# EAGLE design MINI_Sam_2016_09_28_003 (EAGLE 7.6.0)
DESIGNER: BENJAMIN SHOCKLEY; REV: A
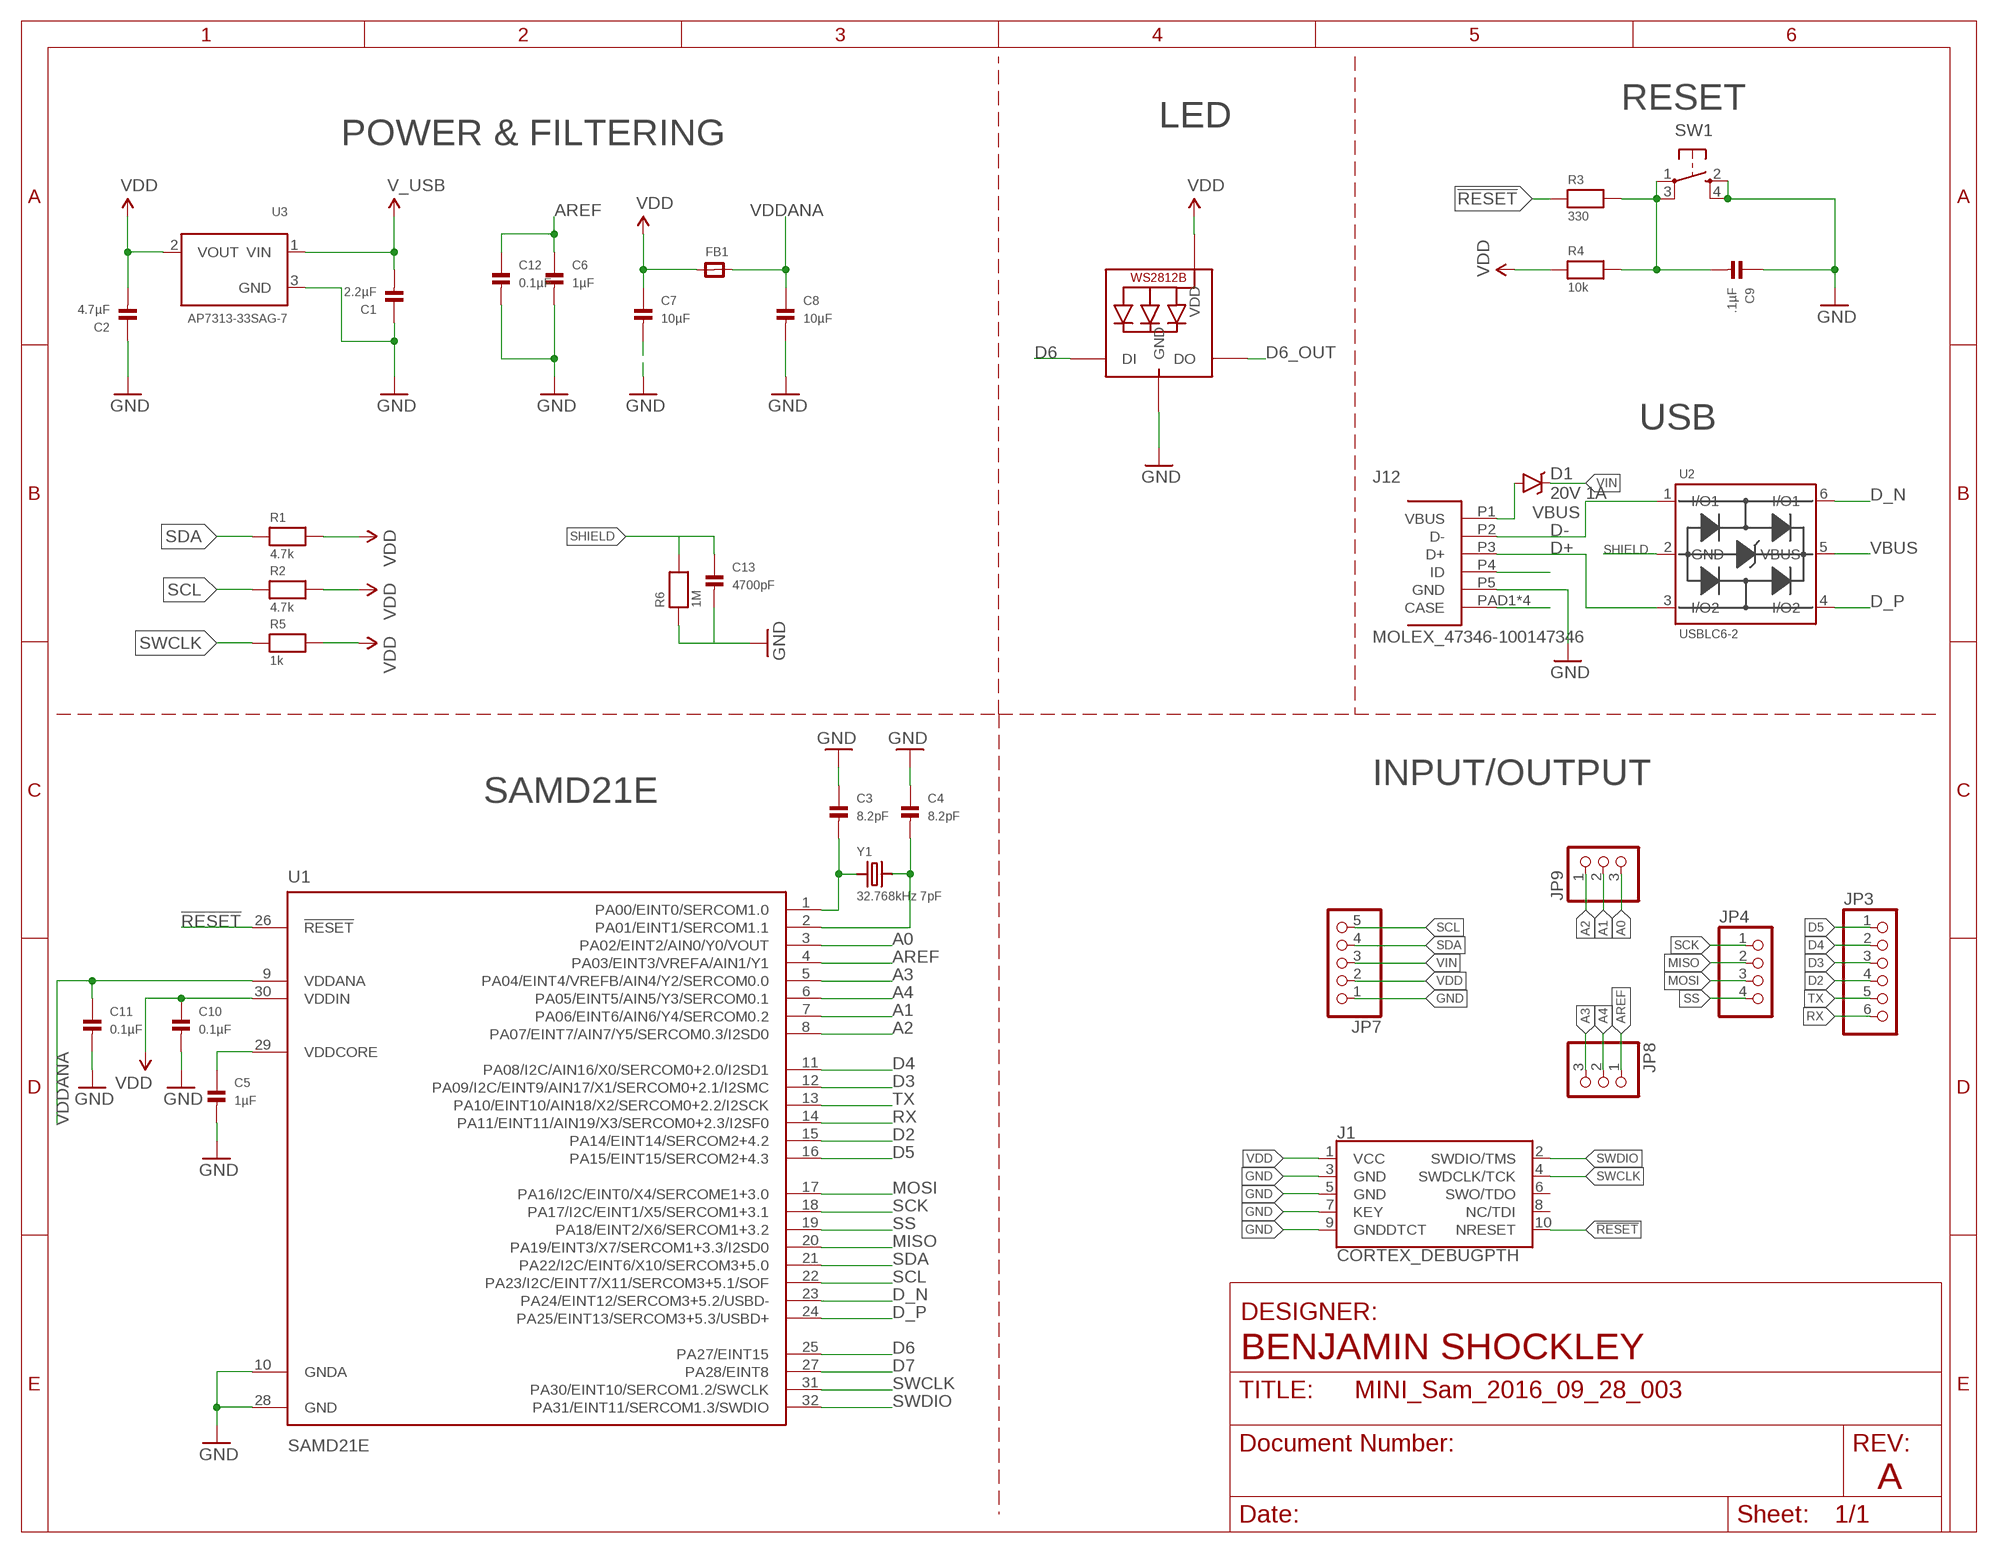
[diagram p0: schematic, sheet 1]

## Parts
C1  2.2µF  CAP_CERAMIC_0805MP  [_0805MP]
C2  4.7µF  CAP_CERAMIC_0805MP  [_0805MP]
C3  8.2pF  CAP_CERAMIC_0805MP  [_0805MP]
C4  8.2pF  CAP_CERAMIC_0805MP  [_0805MP]
C5  1µF  CAP_CERAMIC_0805MP  [_0805MP]
C6  1µF  CAP_CERAMIC_0805MP  [_0805MP]
C7  10µF  CAP_CERAMIC_0805MP  [_0805MP]
C8  10µF  CAP_CERAMIC_0805MP  [_0805MP]
C9  .1µF  CAP_CERAMIC_0805MP  [_0805MP]
C10  0.1µF  CAP_CERAMIC_0805MP  [_0805MP]
C11  0.1µF  CAP_CERAMIC_0805MP  [_0805MP]
C12  0.1µF  CAP_CERAMIC_0805MP  [_0805MP]
C13  4700pF  CAP_CERAMIC_0805MP  [_0805MP]
D1  20V 1A  DIODE-SCHOTTKY-0805  [_0805MP]
FB1  FERRITE_0805MP  [_0805MP]
J1  CORTEX_DEBUGPTH  [2X5-PTH-1.27MM]
J12  MOLEX_47346-100147346  [MOLEX_47346-1001]
JP3  HEADER-1X6ROUND  [1X06_ROUND]
JP4  HEADER-1X4ROUND  [1X04_ROUND]
JP7  HEADER-1X5ROUND  [1X05_ROUND]
JP8  HEADER-1X3ROUND  [1X03_ROUND]
JP9  HEADER-1X3ROUND  [1X03_ROUND]
LED  WS2812B3535  [LED3535]
R1  4.7k  RESISTOR_0805MP  [_0805MP]
R2  4.7k  RESISTOR_0805MP  [_0805MP]
R3  330  RESISTOR_0805MP  [_0805MP]
R4  10k  RESISTOR_0805MP  [_0805MP]
R5  1k  RESISTOR_0805MP  [_0805MP]
R6  1M  RESISTOR_0805MP  [_0805MP]
SW1  SPST_TACT-KMR2  [KMR2]
U1  SAMD21E  [QFN32]
U2  USBLC6-2  [SOT23-6L]
U3  AP7313-33SAG-7  VREG_SOT23  [SOT23-R]
Y1  32.768kHz 7pF  CRYSTAL0805PACKAGE  [_0805MP]

## Nets
!RESET: J1.10(NRESET) R3.1 U1.26(!RESET)
A0: JP9.3 U1.3(PA02/EINT2/AIN0/Y0/VOUT)
A1: JP9.2 U1.7(PA06/EINT6/AIN6/Y4/SERCOM0.2)
A2: JP9.1 U1.8(PA07/EINT7/AIN7/Y5/SERCOM0.3/I2SD0)
A3: JP8.3 U1.5(PA04/EINT4/VREFB/AIN4/Y2/SERCOM0.0)
A4: JP8.2 U1.6(PA05/EINT5/AIN5/Y3/SERCOM0.1)
AREF: C6.1 C12.1 JP8.1 U1.4(PA03/EINT3/VREFA/AIN1/Y1)
D2: JP3.4 U1.15(PA14/EINT14/SERCOM2+4.2)
D3: JP3.3 U1.12(PA09/I2C/EINT9/AIN17/X1/SERCOM0+2.1/I2SMC)
D4: JP3.2 U1.11(PA08/I2C/AIN16/X0/SERCOM0+2.0/I2SD1)
D5: JP3.1 U1.16(PA15/EINT15/SERCOM2+4.3)
D6: LED.1(DI) U1.25(PA27/EINT15)
D6_OUT: LED.3(DO)
D7: U1.27(PA28/EINT8)
D+ [USB_DATA]: J12.P3(D+) U2.3(I/O2)
D- [USB_DATA]: J12.P2(D-) U2.1(I/O1)
D_N [USB_DATA]: U1.23(PA24/EINT12/SERCOM3+5.2/USBD-) U2.6(I/O1)
D_P [USB_DATA]: U1.24(PA25/EINT13/SERCOM3+5.3/USBD+) U2.4(I/O2)
GND: C1.1 C2.1 C3.1 C4.1 C5.2 C6.2 C7.2 C8.2 C9.1 C10.2 C11.2 C12.2 C13.2 J1.3(GND) J1.5(GND) J1.7(KEY) J1.9(GNDDTCT) J12.P5(GND) JP7.1 LED.4(GND) R6.1 SW1.2(S) SW1.4(S1) U1.10(GNDA) U1.28(GND) U3.3(GND)
MISO: JP4.2 U1.20(PA19/EINT3/X7/SERCOM1+3.3/I2SD0)
MOSI: JP4.3 U1.17(PA16/I2C/EINT0/X4/SERCOME1+3.0)
N$1: C3.2 U1.1(PA00/EINT0/SERCOM1.0) Y1.1
N$2: C9.2 R3.2 R4.2 SW1.1(P) SW1.3(P1)
N$5: C4.2 U1.2(PA01/EINT1/SERCOM1.1) Y1.2
N$9: C5.1 U1.29(VDDCORE)
N$10: J12.P4(ID)
RX: JP3.6 U1.14(PA11/EINT11/AIN19/X3/SERCOM0+2.3/I2SF0)
SCK: JP4.1 U1.18(PA17/I2C/EINT1/X5/SERCOM1+3.1)
SCL: JP7.5 R2.1 U1.22(PA23/I2C/EINT7/X11/SERCOM3+5.1/SOF)
SDA: JP7.4 R1.1 U1.21(PA22/I2C/EINT6/X10/SERCOM3+5.0)
SHIELD: C13.1 J12.PAD1(CASE) J12.PAD2(CASE) J12.PAD3(CASE) J12.PAD4(CASE) R6.2 U2.2(GND)
SS: JP4.4 U1.19(PA18/EINT2/X6/SERCOM1+3.2)
SWCLK: J1.4(SWDCLK/TCK) R5.1 U1.31(PA30/EINT10/SERCOM1.2/SWCLK)
SWDIO: J1.2(SWDIO/TMS) U1.32(PA31/EINT11/SERCOM1.3/SWDIO)
TX: JP3.5 U1.13(PA10/EINT10/AIN18/X2/SERCOM0+2.2/I2SCK)
VBUS: D1.1(A) J12.P1(VBUS) U2.5(VBUS)
VDD: C2.2 C7.1 C10.1 FB1.1 J1.1(VCC) JP7.2 LED.2(VDD) R1.2 R2.2 R4.1 R5.2 U1.30(VDDIN) U3.2(VOUT)
VDDANA: C8.1 C11.1 FB1.2 U1.9(VDDANA)
VIN: C1.2 D1.2(C) JP7.3 U3.1(VIN) ; supply symbol labelled V_USB
Unconnected: J1.6(SWO/TDO) J1.8(NC/TDI)

## Notes on the sheet
- RESET
- LED
- POWER & FILTERING
- USB
- INPUT/OUTPUT
- SAMD21E
- DESIGNER:

## Library data of the parts
C1-C13 = microbuilder:CAP_CERAMIC: Ceramic Capacitors 0402 - 0402 Surface Mount Capacitors 16pF 50V 5% [Digikey: 445-4899-2-ND] 18pF 50V 5% [Digikey: 490-1281-2-ND] 22pF 50V 5% [Digikey: 490-1283-2-ND] 68pF 50V 5% [Digikey: 490-1289-2-ND] 0.1uF 10V 10% [Digikey: 490-1318-2-ND] 1.0uF 6.3V 10% [Digikey: 490-1320-2-ND] 0603 - 0603 Surface Mount Capacitors 16 pF 50V 5% [Digikey: 445-5051-2-ND] 22 pF 50V [Digikey: PCC220ACVTR-ND] 33 pF 50V 5% [Digikey: 490-1415-1-ND] 56pF 50V 5% [Digikey: 490-1421-1-ND] 220pF 50V 5% [Digikey: 445-1285-1-ND] 680 pF 50V 2200 pF 50V 5% C0G [Digikey: 445-1297-1-ND] 5600 pF 100V 5% X7R [Digikey: 478-3711-1-ND] 0.1 µF 25V 10% [Digikey: PCC2277TR-ND] 0.22 µF 16V 10% X7R [Digikey: 445-1318-1-ND] 1.0 µF 25V 10% [Digikey: 445-5146-2-ND] 0603 - RF Specific 3pF 250V +/-0.1pF RF [Digikey: 712-1347-1-ND] 18 pF 250V 5% [Digikey: 478-3505-1-ND or 712-1322-1-ND] 56 pF 250V 5% C0G RF [Digikey: 490-4867-1-ND] 68 pF 250V RF [Digikey: 490-4868-1-ND] 0805 - 0805 Surface Mount Capacitors 220 pF 250V 2% RF Ceramic Capacitor [Digikey: 712-1398-1-ND] 1000 pF 50V 2% NP0 Ceramic Capacitor [Digikey: 478-3760-1-ND] 0.1 µF 25V 10% Ceramic Capacitor [Digikey: PCC1828TR-ND] 1.0 µF 16V 10% Ceramic Capacitor[Digikey: 490-1691-2-ND] 10.0 µF 10V 10% Ceramic Capacitor[Digikey: 709-1228-1-ND] 10.0 uF 16V 10% Ceramic Capacitor [Digikey: 478-5165-2-ND] 47 uF 6.3V 20% Ceramic Capacitor [Digikey: 587-1779-1-ND or 399-5506-1-ND] 1206 - 1206 Surface Mount Capacitors 47uF 10V 20% Ceramic Capacitor [Digikey: 490-5528-1-ND or 399-5508-1-ND or 445-6010-1-ND] 100uF 6.3V -20%, +80% Y5V Ceramic Capacitor (Digikey: 490-4512-1-ND, Mouser: 81-GRM31CF50J107ZE1L)
D1 = Shockley_Custom:DIODE-SCHOTTKY: Schottky diodes in SFE's production catalog BAT20J 1A 23V 0.62Vf RB751 120mA 40V 0.37Vf PMEG4005EJ 0.5A 40V 0.42Vf MBRA140 1A 40V 0.5Vf B340A 3A 40V SMA
FB1 = microbuilder:FERRITE: Ferrite Bead 0603 MMZ1608B121C - 120 Ohm @ 100MHz, 600mA, 0.15 Ohm DC Resistance - Digikey: 445-2164-1-ND BK1608HW121-T - 120 Ohm, 600mA Ferrite Chip - Digikey: 587-1876-2-ND 0805 HZ0805B272R-10 - 2.7K Ohm @ 100MHz, 200mA, 0.8 Ohm DC Resistance - Digikey: 240-2504-1-ND (see also Murata BLM21BD272SN1L) MMZ2012Y152B - 1.5K Ohm @ 100MHz, 500mA, 0.4 Ohm DC Resistance - Digikey: 445-1560-1-ND - Mainly for high frequency (80-400MHz) MMZ2012R102A - 1K Ohm @ 100MHz, 500mA, 0.3 Ohm DC Resistance - Digikey: 445-1555-2-ND - More general purpose (10-200MHz)
J1 = SparkFun-Connectors:CORTEX_DEBUG: Cortex Debug Connector Datasheet <http://infocenter.arm.com/help/topic/com.arm.doc.faqs/attached/13634/cortex_debug_connectors.pdf>
J12 = Shockley_Custom:MOLEX_47346-1001
JP3 = microbuilder:HEADER-1X6: PIN HEADER
JP4 = microbuilder:HEADER-1X4: PIN HEADER
JP7 = microbuilder:HEADER-1X5: PIN HEADER
JP8 JP9 = microbuilder:HEADER-1X3: PIN HEADER
LED = adafruit:WS2812B
R1-R6 = microbuilder:RESISTOR: Resistors 0402 - 0402 Surface Mount Package 22 Ohm 1% 1/16W [Digikey: 311-22.0LRTR-ND] 33 Ohm 5% 1/16W 1.0K 5% 1/16W 1.5K 5% 1/16W 2.0K 1% 1/16W 10.0K 1% 1/16W [Digikey: 311-10.0KLRTR-ND] 10.0K 5% 1/16W [Digikey: RMCF0402JT10K0TR-ND] 12.1K 1% 1/16W [Digikey: 311-22.0LRTR-ND] 100.0K 5% 1/16W 0603 - 0603 Surface Mount Package 0 Ohm 1/10 Watt 1% Resistor 15 Ohm 1/10 Watt 1% Resistor 33 Ohm 1/10 Watt 1% Resistor 49.9 Ohm 1/10 Watt 1% Resistor 100 Ohm 1/10 Watt 1% Resistor 150 Ohm 1/10 Watt 1% Resistor 240 Ohm 1/10 Watt 1% Resistor 390 Ohm 1/10 Watt 1% Resistor 560 Ohm 1/10 Watt 1% Resistor 680 Ohm 1/10 Watt 1% Resistor 750 Ohm 1/10 Watt 1% Resistor 1.0K Ohm 1/10 Watt 1% Resistor 1.5K Ohm 1/10 Watt 1% Resistor 2.0K Ohm 1/10 Watt 1% Resistor 2.2K Ohm 1/10 Watt 1% Resistor 3.3K Ohm 1/10 Watt 1% Resistor 4.7K Ohm 1/10 Watt 1% Resistor 10.0K Ohm 1/10 Watt 1% Resistor 12.0K Ohm 1/10 Watt 1% Resistor 12.1K Ohm 1/10 Watt 1% Resistor 20.0K Ohm 1/10 Watt 1% Resistor 33.0K Ohm 1/10 Watt 1% Resistor 100.0K Ohm 1/10 Watt 1% Resistor 0805 - 0805 Surface Mount Package 0 Ohm 1/8 Watt 1% Resistor 33 Ohm 1/8 Watt 1% Resistor 100 Ohm 1/8 Watt 1% Resistor 150 Ohm 1/8 Watt 1% Resistor 200 Ohm 1/8 Watt 1% Resistor 240 Ohm 1/8 Watt 1% Resistor 330 Ohm 1/8 Watt 1% Resistor 390 Ohm 1/8 Watt 1% Resistor 470 Ohm 1/8 Watt 1% Resistor 1.0K Ohm 1/8 Watt 1% Resistor 1.5K Ohm 1/8 Watt 1% Resistor 2.0K Ohm 1/8 Watt 1% Resistor 4.7K Ohm 1/8 Watt 1% Resistor 5.1K Ohm 1/8 Watt 1% Resistor 5.6K Ohm 1/8 Watt 1% Resistor 10.0K Ohm 1/8 Watt 1% Resistor 22.0K Ohm 1/8 Watt 1% Resistor 33.0K Ohm 1/8 Watt 1% Resistor 100K Ohm 1/8 Watt 1% Resistor 1206 - 1206 Surface Mount Package 2012 - 2010 Surface Mount Package 0.11 Ohm 1/2 Watt 1% Resistor - Digikey: RHM.11UCT-ND
SW1 = adafruit:SPST_TACT: SMT 6mm switch, EVQQ2 series http://www.ladyada.net/library/eagle
U1 = Shockley_Custom:SAMD21E
U2 = Shockley_Custom:USBLC6-2
U3 = microbuilder:VREG_SOT23: SOT23 Fixed Voltage Regulators Part Current Out V Out V In V Dropout Digikey Part No. AP7313 150mA 3.3V 3.5-6V 0.15V @ 150mA AP7313-33SAG-7DICT-ND
Y1 = Shockley_Custom:CRYSTAL: Crystals HC49UP - Surface Mount Crystal 4.0MHz 18pF +/-30ppm Surface Mount Crystal [Digikey: 535-9857-1-ND] 12.0 MHz Surface Mount Crystal [Digikey: 535-9869-6-ND] 25.0 MHz Surface Mount Crystal [Digikey: 535-9078-1-ND] 2.5 x 2.0mm - MEMs SMT Crystal 16.0 MHz 10pF 20ppm 2.5 x 2.0mm Crystal [Digikey -40-85°C: 535-10923-1-ND] 3.2 x 2.5mm - MEMs SMT Crystal 12.0 MHz 8pF 15ppm 3.2 x 2.5mm Crystal [Digikey: -10-70°C: 644-1047-1-ND -40-125°C: 644-1128-1-ND] 16.0 MHz 8pF 15ppm 3.2 x 2.5mm Crystal [Digikey: -10-70°C: 644-1049-1-ND -40-125°C: 644-1129-2-ND] 16.0 MHz 10pF 10ppm 3.2 x 2.5mm Crystal [Digikey: 644-1100-1-ND] 27.12 MHz 18pF 30ppm 3.2 x 2.5mm Crystal [Digikey: 887-1424-1-ND] 27.12MHz 10pF 10ppm 3.2 x 2.5mm Crystal [Digikey: 887-1329-1-ND] 4.9 x 1.8mm - MEMs SMT Crystal 32.768 KHz 12.5pF 20ppm 4.9 x 1.8mm Crystal [Digikey: SE2415CT-ND] 8.0 x 3.8mm - Surface Mount Crystal 32.768kHz 12.5pF 20ppm -40°C-85°C [Digikey: 535-9166-2-ND] Cylinder 32.768KHz Cylinder Crystal (2x6mm body) [Ex. Digikey: 300-8341-2-ND]

## Board
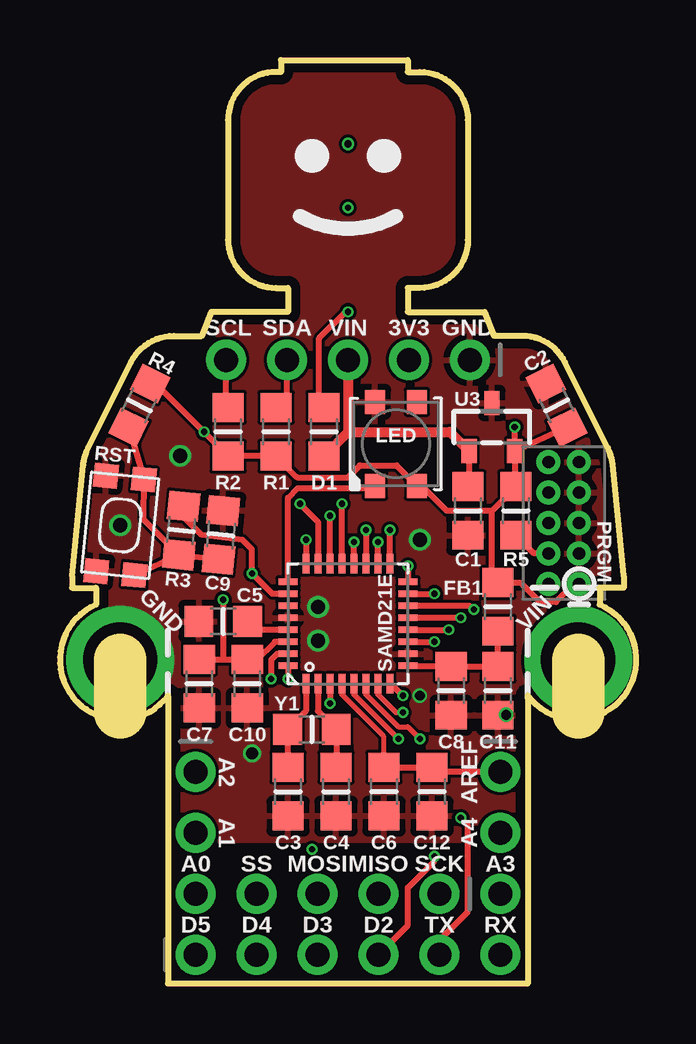
[diagram p1: board, top side]
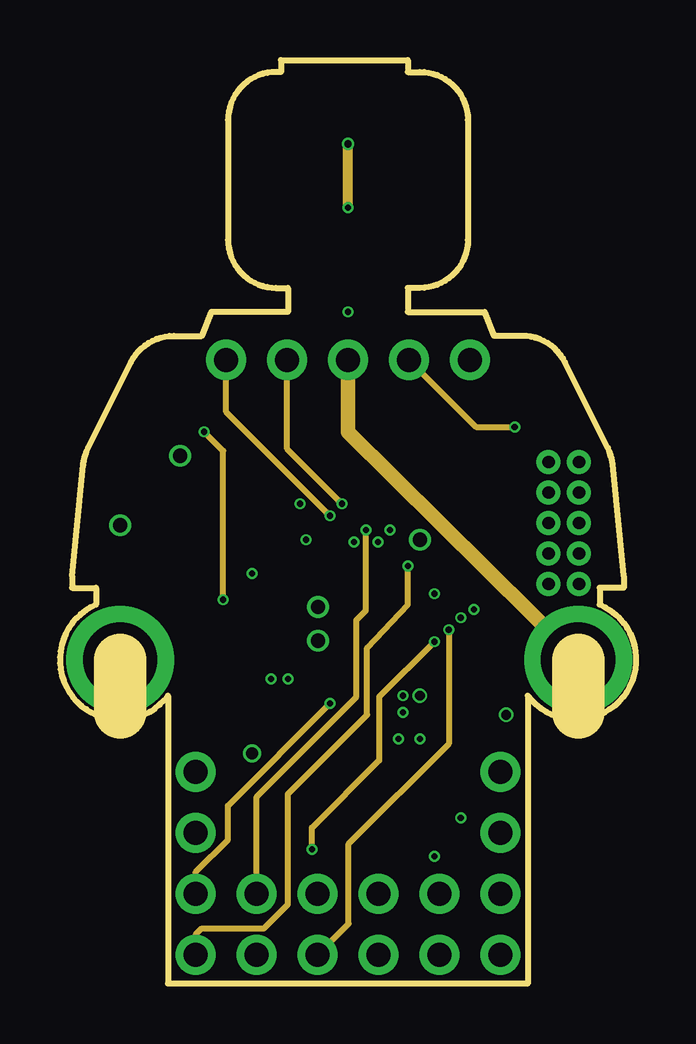
[diagram p2: board, inner layer Route2]
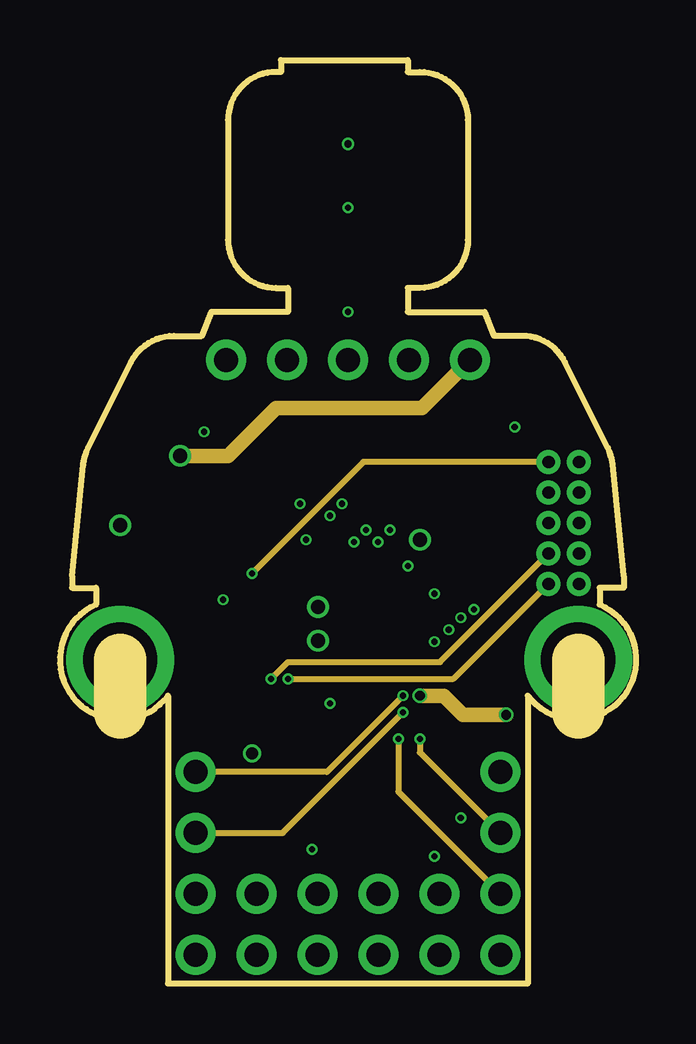
[diagram p3: board, inner layer Route15]
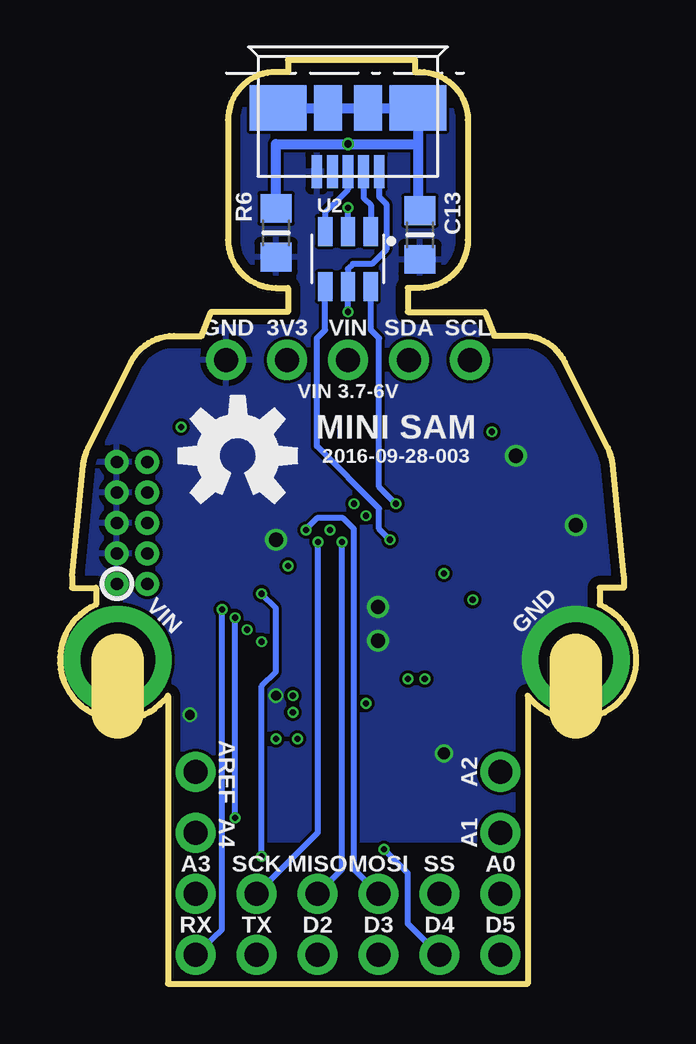
[diagram p4: board, bottom side, seen from below]

Size 24.02 x 38.5 mm. Coordinates in mm from the lower left corner, seen from the top.
Outline: 9.21,38.5 14.51,38.5 14.51,38 15.01,38 arc-90 17.01,36 17.01,31 arc-90 15.01,29 14.51,29 14.51,28 17.71,28 18.11,27 19.27,27 arc-63 21.06,25.89 22.84,22.33 arc-21 23.05,21.63 23.51,17 23.51,16.5 22.51,16.5 22.51,15.8 arc-210 19.51,12 19.51,0 4.51,0 4.51,12 arc-210 1.51,15.8 1.51,16.5 0.51,16.5 0.51,17 0.97,21.63 arc-21 1.17,22.33 2.96,25.89 arc-63 4.75,27 5.91,27 6.31,28 9.51,28 9.51,29 9.01,29 arc-90 7.01,31 7.01,36 arc-90 9.01,38 9.21,38 9.21,38.5
Copper layers (1*2*15*16): Top 0.035559375mm / dielectric 0.17018125mm / Route2 0.01778125mm / dielectric 47mil / Route15 0.01778125mm / dielectric 0.17018125mm / Bottom 0.035559375mm
Design rules "OSHPark-4layer": minimum track width 5mil, minimum drill 10mil, track to track 5mil, track to pad 5mil, pad to pad 5mil, via to via 5mil, smd to smd 5mil, copper to edge 15mil, drill to drill 6mil, minimum pad ring 4mil, minimum via ring 4mil, stop-mask expansion 2.5mil, vias tented up to drill 0mil, thermal gap 10mil
Milling: 2 lines

### Footprints (pad centres in the part's own frame; a part is rotated, then mirrored left to right if it is on the bottom)
_0805MP = smd 1.2 x 1.3: 1 -1.016,0; 2 1.016,0
2X5-PTH-1.27MM = drill 0.508 pad 1: 1 -2.54,-0.635; 2 -2.54,0.635; 3 -1.27,-0.635; 4 -1.27,0.635; 5 0,-0.635; 6 0,0.635; 7 1.27,-0.635; 8 1.27,0.635; 9 2.54,-0.635; 10 2.54,0.635
MOLEX_47346-1001 = smd 0.45 x 1.38: P1 1.3,-2.66; P2 0.65,-2.66; P3 0,-2.66; P4 -0.65,-2.66; P5 -1.3,-2.66 | smd 2.375 x 1.9: PAD1 -2.913,0; PAD4 2.913,0 | smd 1.175 x 1.9: PAD2 -0.838,0; PAD3 0.838,0
1X06_ROUND = drill 1 pad 1.676: 1 -6.35,0; 2 -3.81,0; 3 -1.27,0; 4 1.27,0; 5 3.81,0; 6 6.35,0
1X04_ROUND = drill 1 pad 1.676: 1 -3.81,0; 2 -1.27,0; 3 1.27,0; 4 3.81,0
1X05_ROUND = drill 1 pad 1.676: 1 -5.08,0; 2 -2.54,0; 3 0,0; 4 2.54,0; 5 5.08,0
1X03_ROUND = drill 1 pad 1.676: 1 -2.54,0; 2 0,0; 3 2.54,0
LED3535 = smd 1 x 0.85: 1 -1.75,0.875; 2 -1.75,-0.875; 3 1.75,-0.875; 4 1.75,0.875
KMR2 = smd 1 x 1: 1 2,0.8; 2 2,-0.8; 3 -2,0.8; 4 -2,-0.8
QFN32 = smd 0.8 x 0.285: 1 -2.5,1.75; 2 -2.5,1.25; 3 -2.5,0.75; 4 -2.5,0.25; 5 -2.5,-0.25; 6 -2.5,-0.75; 7 -2.5,-1.25; 8 -2.5,-1.75; 17 2.5,-1.75; 18 2.5,-1.25; 19 2.5,-0.75; 20 2.5,-0.25; 21 2.5,0.25; 22 2.5,0.75; 23 2.5,1.25; 24 2.5,1.75 | smd 0.285 x 0.8: 9 -1.75,-2.5; 10 -1.25,-2.5; 11 -0.75,-2.5; 12 -0.25,-2.5; 13 0.25,-2.5; 14 0.75,-2.5; 15 1.25,-2.5; 16 1.75,-2.5; 25 1.75,2.5; 26 1.25,2.5; 27 0.75,2.5; 28 0.25,2.5; 29 -0.25,2.5; 30 -0.75,2.5; 31 -1.25,2.5; 32 -1.75,2.5
SOT23-6L = smd 0.6 x 1.2: 1 -0.95,-1.15; 2 0,-1.15; 3 0.95,-1.15; 4 0.95,1.15; 5 0,1.15; 6 -0.95,1.15
SOT23-R = smd 0.635 x 1.016: 1 -0.95,-1; 2 0.95,-1; 3 0,1

### Placement (x,y rotation side)
C1  17.01,19.7 90 top
C2  20.71,24.1 296.5 top
C3  9.51,8 90 top
C4  11.51,8 90 top
C5  6.81,15.1 180 top
C6  13.51,8 270 top
C7  5.81,12.5 270 top
C8  16.31,12.2 270 top
C9  6.71,18.7 264.3 top
C10  7.81,12.5 270 top
C11  18.26,12.2 270 top
C12  15.51,8 270 top
C13  9.01,31.2 270 bottom
D1  11.01,23 270 top
FB1  18.26,15.7 270 top
J1  21.01,19.2 90 top
J12  12.01,36.5 0 bottom
JP3  12.01,1.2 0 top
JP4  12.01,3.74 180 top
JP7  12.01,26 180 top
JP8  18.36,6.28 270 top
JP9  5.66,6.28 270 top
LED  14.01,22.5 90 top
R1  9.01,23 270 top
R2  7.01,23 270 top
R3  5.06,18.88 264.3 top
R4  3.31,24.1 243.5 top
R5  19.01,19.7 90 top
R6  15.01,31.3 90 bottom
SW1  2.51,19.1 264.3 top
U1  12.01,15 90 top
U2  12.01,30.2 180 bottom
U3  18.01,23.2 0 top
U$1  [OSHW-LOGO-M]  16.61,22 0 bottom
Y1  10.51,10.6 0 top

### Tracks (layer width: path | path; a pad name or v marks a point on that pad's centre or on a via)
!RESET  (via drill 0.25)
  Top 0.254: U1.26 8.86,16.25 v8.01,17.1 8.01,18.1 7.61,18.5 5.91,18.7 5.16,19.45 R3.1
  Route15 0.254: J1.10 12.65,21.74 v8.01,17.1
A0  (via drill 0.25)
  Top 0.254: U1.3 v11.27,11.67
  Route2 0.254: JP9.3 5.66,4.65 7.01,6 7.01,7.41 v11.27,11.67
A1  (via drill 0.25)
  Top 0.203: U1.7 13.26,12.05 14.01,11.3 v14.31,11.3
  Route15 0.254: JP9.2 9.29,6.28 v14.31,11.3
A2  (via drill 0.25)
  Top 0.254: U1.8 13.81,12.5 v14.31,12
  Route15 0.254: v14.31,12 11.13,8.82 JP9.1
A3  (via drill 0.25)
  Top 0.203: U1.5 12.26,12.05 v14.11,10.2
  Route15 0.254: v14.11,10.2 14.11,7.99 JP8.3
A4  (via drill 0.25)
  Top 0.203: U1.6 12.76,12.05 14.11,10.7 14.51,10.7 v15.01,10.2
  Route15 0.254: v15.01,10.2 15.01,9.63 JP8.2
AREF
  Top 0.203: C6.1 13.51,10.3 11.76,12.05 U1.4
  Top 0.254: C6.1 C12.1 15.21,8.82 JP8.1
D2  (via drill 0.25)
  Top 0.254: JP3.4 14.51,2.43 14.51,4 15.61,5.1 v15.61,5.3 | U1.15 v15.61,16.25
  Bottom 0.254: v15.61,5.3 15.61,12.4 15.01,13 15.01,15.65 v15.61,16.25
D3  (via drill 0.25)
  Top 0.254: U1.12 v16.21,14.75
  Route2 0.254: JP3.3 12.04,2.5 12.04,5.83 16.21,10 v16.21,14.75
D4  (via drill 0.25)
  Top 0.254: U1.11 v15.61,14.25
  Route2 0.254: v15.61,14.25 13.31,11.95 13.31,9.3 10.51,6.5 v10.51,5.6
  Bottom 0.254: JP3.2 9.51,2.5 9.51,4.6 v10.51,5.6
D5  (via drill 0.25)
  Top 0.254: v14.51,17.4 U1.16
  Route2 0.254: JP3.1 5.66,2.05 5.91,2.3 8.51,2.3 9.51,3.3 9.51,7.9 12.81,11.2 12.81,14 14.51,15.8 v14.51,17.4
D6
  Top 0.254: LED.1 13.03,20.65 9.91,20.65 9.51,20.25 U1.25
D+
  Bottom 0.254: J12.P3 12.01,33.1 12.96,32.15 U2.3
D-
  Bottom 0.254: J12.P2 11.36,32.75 11.06,32.45 U2.1
D_N  (via drill 0.25)
  Top 0.254: v10.01,20 10.76,19.25 U1.23
  Bottom 0.254: v10.01,20 10.71,20.7 10.71,26.9 11.06,27.25 U2.6
D_P  (via drill 0.25)
  Top 0.254: v10.26,18.5 U1.24
  Bottom 0.254: v10.26,18.5 10.71,18.95 10.71,19.8 13.31,22.4 13.31,26.9 12.96,27.25 U2.4
GND  (via drill 0.4, 0.5, 0.6, 3.1 pad 4.5)
  Route15 0.61: JP7.1 15.09,24 9.01,24 7.01,22 v5.01,22 | v15.01,12 16.01,12 16.81,11.2 v18.61,11.2
  other vias: 2.51,13.5 2.51,19.1 10.76,15.7 15.01,18.5 8.01,9.6 10.76,14.3
  pour Top: 0.01,6 24.01,6 24.01,38 0.01,38
  pour Bottom: 0.01,6 24.01,6 24.01,38 0.01,38
MISO  (via drill 0.25)
  Top 0.254: U1.20 v12.26,18.4
  Bottom 0.254: JP4.2 12.26,4.76 v12.26,18.4
MOSI  (via drill 0.25)
  Top 0.254: U1.17 v13.76,18.9
  Bottom 0.254: v13.76,18.9 13.76,18.95 13.31,19.4 12.21,19.4 11.76,18.95 11.76,4.76 JP4.3
N$1
  Top 0.254: U1.1 10.26,11.37 Y1.1 9.51,10.58 C3.2
N$2
  Top 0.254: R3.2 C9.2 | R3.2 SW1.1 | R4.2 SW1.3 3.49,19.34 R3.2
N$5
  Top 0.254: U1.2 10.76,11.36 Y1.2 11.52,9.03 C4.2
N$9
  Top 0.254: U1.29 8.18,14.75 C5.1
RX  (via drill 0.25)
  Top 0.254: v17.26,15.6 17.06,15.75 U1.14
  Bottom 0.254: JP3.6 17.26,2.25 v17.26,15.6
SCK  (via drill 0.25)
  Top 0.254: U1.18 v13.26,18.4
  Bottom 0.254: JP4.1 13.26,6.3 v13.26,18.4
SCL  (via drill 0.25)
  Top 0.254: R2.1 6.93,24.1 JP7.5 | U1.22 v11.26,19.5
  Route2 0.254: v11.26,19.5 6.93,23.83 JP7.5
SDA  (via drill 0.25)
  Top 0.254: R1.1 9.47,24.48 JP7.4 | U1.21 v11.76,20
  Route2 0.254: v11.76,20 9.47,22.29 JP7.4
SHIELD  (via drill 0.25, 0.3)
  Route2 0.406: v12.01,32.35 v12.01,35
  Bottom 0.254: U2.2 v12.01,32.35
  Bottom 0.406: J12.PAD1 J12.PAD2 J12.PAD3 J12.PAD4 9.1,35 | 9.1,35 9.1,32.3 C13.1 | R6.2 15.01,35 v12.01,35 9.1,35
SS  (via drill 0.25)
  Top 0.254: v12.76,18.9 U1.19
  Route2 0.254: JP4.4 8.2,7.79 12.36,11.95 12.36,15.15 12.76,15.55 v12.76,18.9
SWCLK  (via drill 0.25)
  Top 0.254: U1.31 9.06,13.75 8.81,13.5 v8.81,12.7 | J1.4 19.76,17.93 R5.1
  Route15 0.254: J1.4 15.84,13.4 9.51,13.4 v8.81,12.7
SWDIO  (via drill 0.25)
  Top 0.254: U1.32 v9.51,12.7
  Route15 0.254: v9.51,12.7 16.41,12.7 J1.2
TX  (via drill 0.25)
  Top 0.254: v16.71,15.25 U1.13 | JP3.5 15.82,1.81 17.01,3 17.01,6.6 v16.71,6.9
  Bottom 0.254: v16.71,6.9 v16.71,15.25
VBUS  (via drill 0.25)
  Top 0.254: D1.1 10.81,24.22 10.81,26.9 11.91,28 v12.01,28
  Bottom 0.254: J12.P1 10.71,32.8 10.41,32.5 10.41,30.6 11.01,30 11.81,30 12.01,29.8 U2.5 v12.01,28
VDD  (via drill 0.25)
  Top 0.254: U1.30 8.96,14.25 8.23,13.52 C10.1 | R4.1 3.98,25.01 R2.2 | U3.2 18.96,20.67 R5.2 18.91,20.5 18.81,20.5 18.01,19.7 | U3.2 C2.2 | 18.01,19.7 18.01,16.77 FB1.1 19.19,16.72 20.01,15.9 20.68,15.9 21.44,16.66 J1.1 | 18.01,19.7 16.13,19.7 15.08,20.75 LED.2 14.03,21.6 12.51,21.6 12.01,21.1 9.89,21.1 R1.2 8.99,22 8.99,21.98 R2.2 | U3.2 v18.96,23.2 | 7.79,13.5 C10.1 | v6.81,16 6.81,13.52 | 6.81,13.52 C10.1 | C7.1 6.81,13.52 | R2.2 v6.01,23
  Route2 0.254: JP7.2 17.35,23.2 v18.96,23.2 | v6.81,16 6.81,22.2 v6.01,23
VDDANA
  Top 0.254: U1.9 15.98,13.25 C8.1 C11.1 FB1.2
VIN  (via drill 3.1 pad 4.5)
  Top 0.254: 12.01,23 12.01,22.98 | 11.03,22 D1.2 | U3.1 17.06,20.67 C1.2
  Top 0.305: 11.03,22 11.03,22.02 12.01,23
  Top 0.406: JP7.3 12.01,23 16.26,23 U3.1 | 12.01,22.98 11.03,22
  Route2 0.61: v21.61,13.5 12.01,23 JP7.3

### Text on the board
tPlace: GND | VIN
tNames: SCL | SDA | VIN | 3V3 | GND | RST | PRGM | A2 | AREF | A1 | A4 | A0 | SS | MOSI | MISO | SCK | A3 | D5 | D4 | D3 | D2 | TX | RX
bNames: SCL | SDA | VIN | 3V3 | GND | VIN 3.7-6V | MINI SAM | 2016-09-28-003 | GND | VIN | A2 | AREF | A1 | A4 | A0 | SS | MOSI | MISO | SCK | A3 | D5 | D4 | D3 | D2 | TX | RX